# EAGLE design Main_Backup2 (EAGLE 7.2.0)
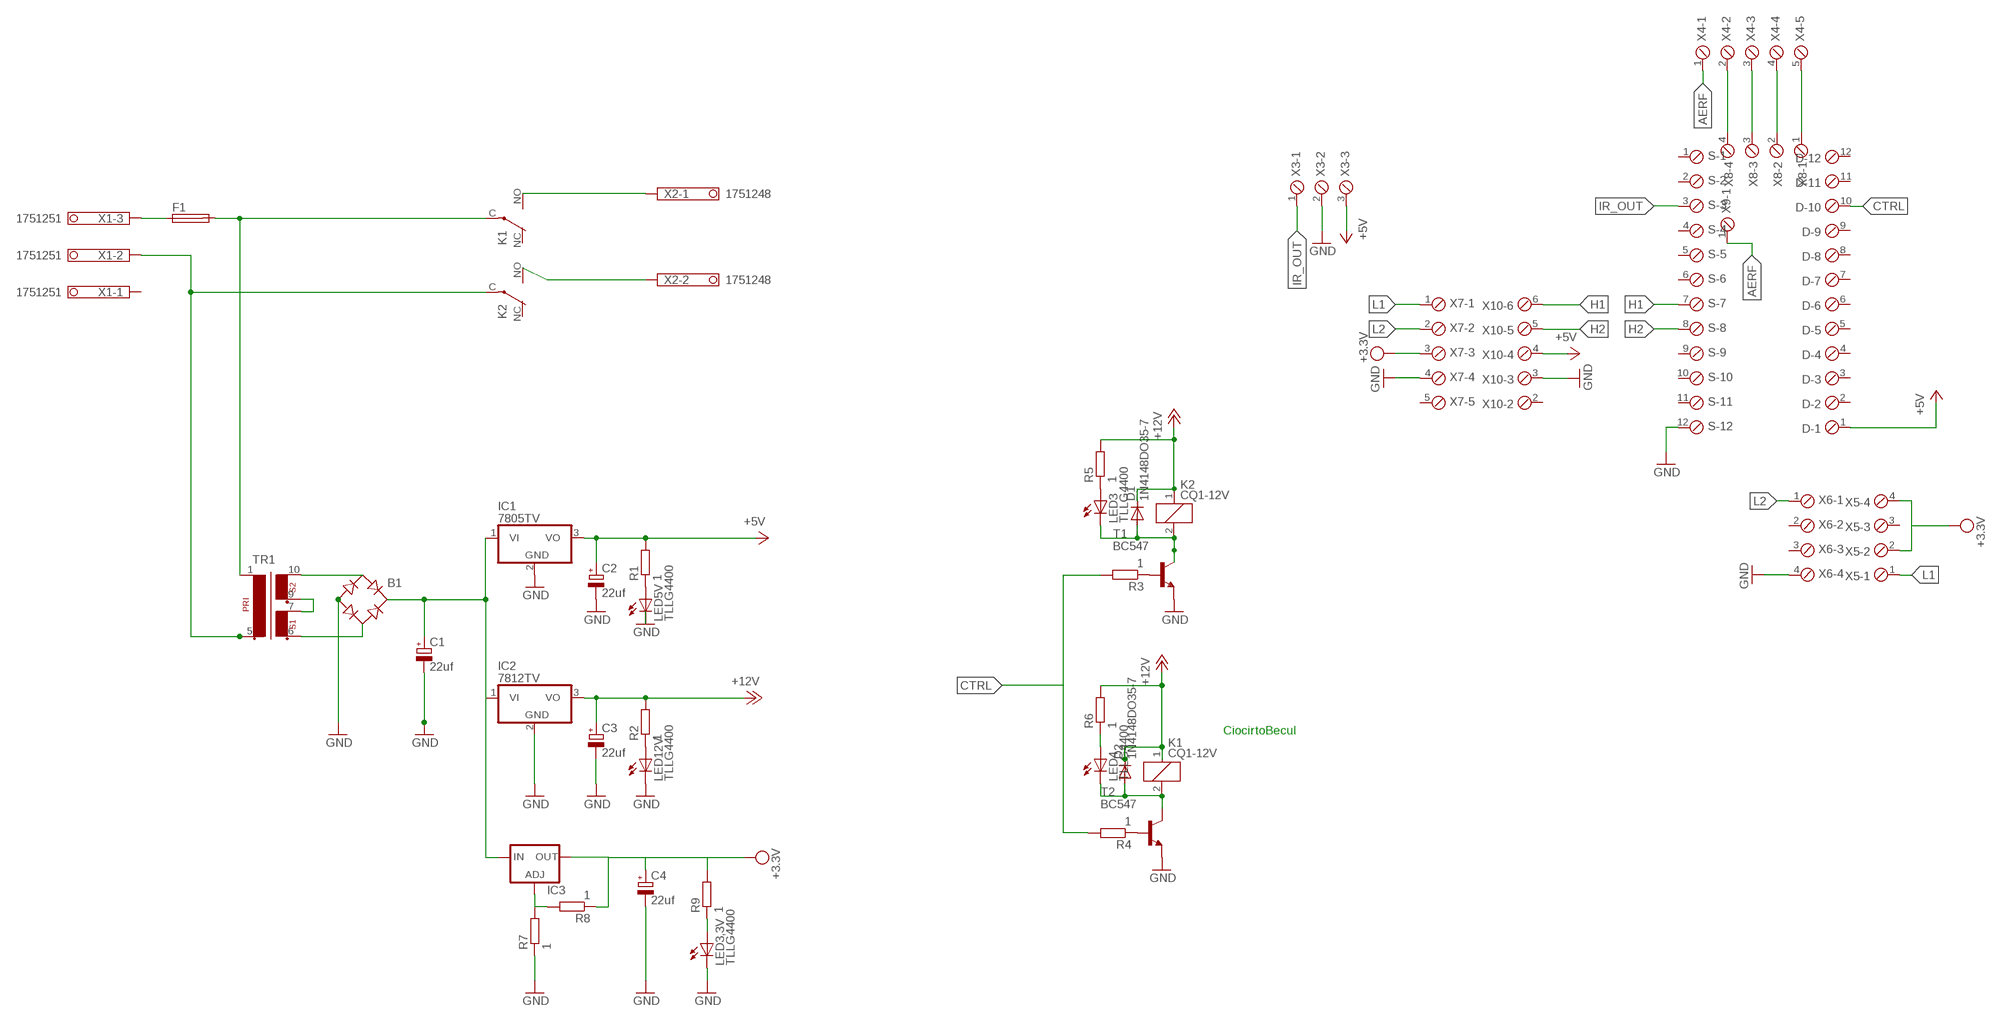
[diagram p0: schematic, sheet 1]

## Parts
B1  RB1A  [RB1A]
C1  22uf  CPOL-EUE2-4  [E2-4]
C2  22uf  CPOL-EUE2-4  [E2-4]
C3  22uf  CPOL-EUE2-4  [E2-4]
C4  22uf  CPOL-EUE2-4  [E2-4]
D  MPT12  [12POL254]
D1  1N4148DO35-7  [DO35-7]
D2  1N4148DO35-7  [DO35-7]
F1  SH25  [SH25]
IC1  7805TV  [TO220V]
IC2  7812TV  [TO220V]
IC3  LM317TS  [317TS]
K1  CQ1-12V  [CQ1]
K2  CQ1-12V  [CQ1]
LED3  TLLG4400  [LED3MM]
LED3,3V  TLLG4400  [LED3MM]
LED4  TLLG4400  [LED3MM]
LED5V  TLLG4400  [LED3MM]
LED12V  TLLG4400  [LED3MM]
R1  1  R-EU_0204/5  [0204/5]
R2  1  R-EU_0204/5  [0204/5]
R3  1  R-EU_0204/5  [0204/5]
R4  1  R-EU_0204/5  [0204/5]
R5  1  R-EU_0204/5  [0204/5]
R6  1  R-EU_0204/5  [0204/5]
R7  1  R-EU_0204/5  [0204/5]
R8  1  R-EU_0204/5  [0204/5]
R9  1  R-EU_0204/5  [0204/5]
S  MPT12  [12POL254]
T1  BC547  [TO92]
T2  BC547  [TO92]
TR1  EI30-2  [EI30-2]
X1  1751251  [1751251]
X2  1751248  [1751248]
X3  MPT3  [3POL254]
X4  MPT5  [5POL254]
X5  MPT4  [4POL254]
X6  MPT4  [4POL254]
X7  MPT6  [6POL254]
X8  MPT4  [4POL254]
X9  MPT2  [2POL254]
X10  MPT6  [6POL254]

## Nets
+5V: C2.+ D.1 IC1.3(VO) R1.2 X3.3 X10.4
+12V: C3.+ D1.C D2.C IC2.3(VO) K1.1 K2.1 R2.2 R5.2 R6.2
AERF: X4.1 X9.1
CTRL: D.10 R3.2 R4.2
GND: B1.- C1.- C2.- C3.- C4.- IC1.2(GND) IC2.2(GND) LED3,3V.K(C) LED5V.K(C) LED12V.K(C) R7.1 S.12 T1.1(E) T2.1(E) X3.2 X6.4 X7.4 X10.3
H1: S.7 X10.6
H2: S.8 X10.5
IR_OUT: S.3 X3.1
L1: X5.1 X7.1
L2: X6.1 X7.2
N$1: F1.2 K1.C(2:P) TR1.1
N$2: K2.C(2:P) TR1.5 X1.2
N$3: K1.NO(2:S) X2.1
N$4: K2.NO(2:S) X2.2
N$5: TR1.7 TR1.9
N$6: B1.AC1 TR1.10
N$7: B1.AC2 TR1.6
N$8: B1.+ C1.+ IC1.1(VI) IC2.1(VI) IC3.3(IN)
N$9: D1.A K2.2 LED3.K(C) T1.3(C)
N$10: LED12V.A R2.1
N$11: LED3.A R5.1
N$12: D2.A K1.2 LED4.K(C) T2.3(C)
N$13: LED5V.A R1.1
N$14: R3.1 T1.2(B)
N$15: R4.1 T2.2(B)
N$16: X4.5 X8.1
N$17: F1.1 X1.3
N$18: LED4.A R6.1
N$19: IC3.1(ADJ) R7.2 R8.2
N$20: LED3,3V.A R9.1
N$23: X4.3 X8.3
N$24: X4.4 X8.2
N$25: X4.2 X8.4
VCC: C4.+ IC3.2(OUT) R8.1 R9.2 X5.2 X5.4 X7.3 ; supply symbol labelled +3.3V
Unconnected: D.2 D.3 D.4 D.5 D.6 D.7 D.8 D.9 D.11 D.12 K1.NC(2:O) K2.NC(2:O) S.1 S.2 S.4 S.5 S.6 S.9 S.10 S.11 X1.1 X5.3 X6.2 X6.3 X7.5 X7.6 X9.2 X10.1 X10.2

## Notes on the sheet
- CiocirtoBecul

## Library data of the parts
B1 = rectifier:RB1A: RECTIFIER 1 A
C1-C4 = rcl:CPOL-EU: POLARIZED CAPACITOR, European symbol
D S = con-phoenix-254:MPT12: PHOENIX CONNECTOR; OC_FARNELL: unknown; OC_NEWARK: unknown
D1 D2 = diode:1N4148: DIODE high speed (Philips)
F1 = fuse:SH25: FUSE HOLDER grid 25 mm, OGN0031 8211, Schurter (Buerklin); MF: SCHURTER; MPN: 0031.8211; OC_FARNELL: 1162741; OC_NEWARK: 96B9380
IC1 IC2 = linear:78*: Positive VOLTAGE REGULATOR Source: http://cache.national.com/ds/LM/LM78L05.pdf http://www.fairchildsemi.com/ds/LM/LM7805.pdf
IC3 = v-reg:LM317TS: VOLTAGE REGULATOR
K1 K2 = relay:CQ1-12V: AUTOMOTIVE QUIET RELAY NAiS Source: http://www.mew-europe.com/.. en_ds_61208_0000.pdf; OC_FARNELL: unknown; OC_NEWARK: unknown
LED3 LED3,3V LED4 LED5V LED12V = led:TLLG4400: Low Current (2mA) LED 3 mm Tinted Diffused Package color GREEN Source: Data sheet <http://www.farnell.com/datasheets/391098.pdf>; MF: VISHAY SEMICONDUCTOR; OC_FARNELL: 1612435
R1-R9 = rcl:R-EU_: RESISTOR, European symbol
T1 T2 = transistor:BC547: NPN TRANSISTOR
TR1 = trafo:EI30-2: TRANSFORMER 1 primary winding, 2 secondary windings ERA
X1 = con-phoenix-350:1751251: MKDS 1/ 3-3,5 Printklemme Nennstrom: 10 A Bemessungsspannung: 160 V Raster: 3,5 mm Polzahl: 3 Montageart: Löten Anschlussart: Schraubanschluss Anschlussrichtung vom Leiter zur Platine: 0° Source: http://eshop.phoenixcontact.com .. 1751251.pdf; OC_FARNELL: unknown; OC_NEWARK: unknown
X2 = con-phoenix-350:1751248: MKDS 1/ 2-3,5 Printklemme Nennstrom: 10 A Bemessungsspannung: 160 V Raster: 3,5 mm Polzahl: 2 Montageart: Löten Anschlussart: Schraubanschluss Anschlussrichtung vom Leiter zur Platine: 0° Source: http://eshop.phoenixcontact.com .. 1751248.pdf; OC_FARNELL: unknown; OC_NEWARK: unknown
X3 = con-phoenix-254:MPT3: PHOENIX CONNECTOR; OC_FARNELL: unknown; OC_NEWARK: unknown
X4 = con-phoenix-254:MPT5: PHOENIX CONNECTOR; OC_FARNELL: unknown; OC_NEWARK: unknown
X5 X6 X8 = con-phoenix-254:MPT4: PHOENIX CONNECTOR; OC_FARNELL: unknown; OC_NEWARK: unknown
X7 X10 = con-phoenix-254:MPT6: PHOENIX CONNECTOR; OC_FARNELL: unknown; OC_NEWARK: unknown
X9 = con-phoenix-254:MPT2: PHOENIX CONNECTOR; OC_FARNELL: unknown; OC_NEWARK: unknown

## Net classes
0 default: width 0.61 mm

## Board
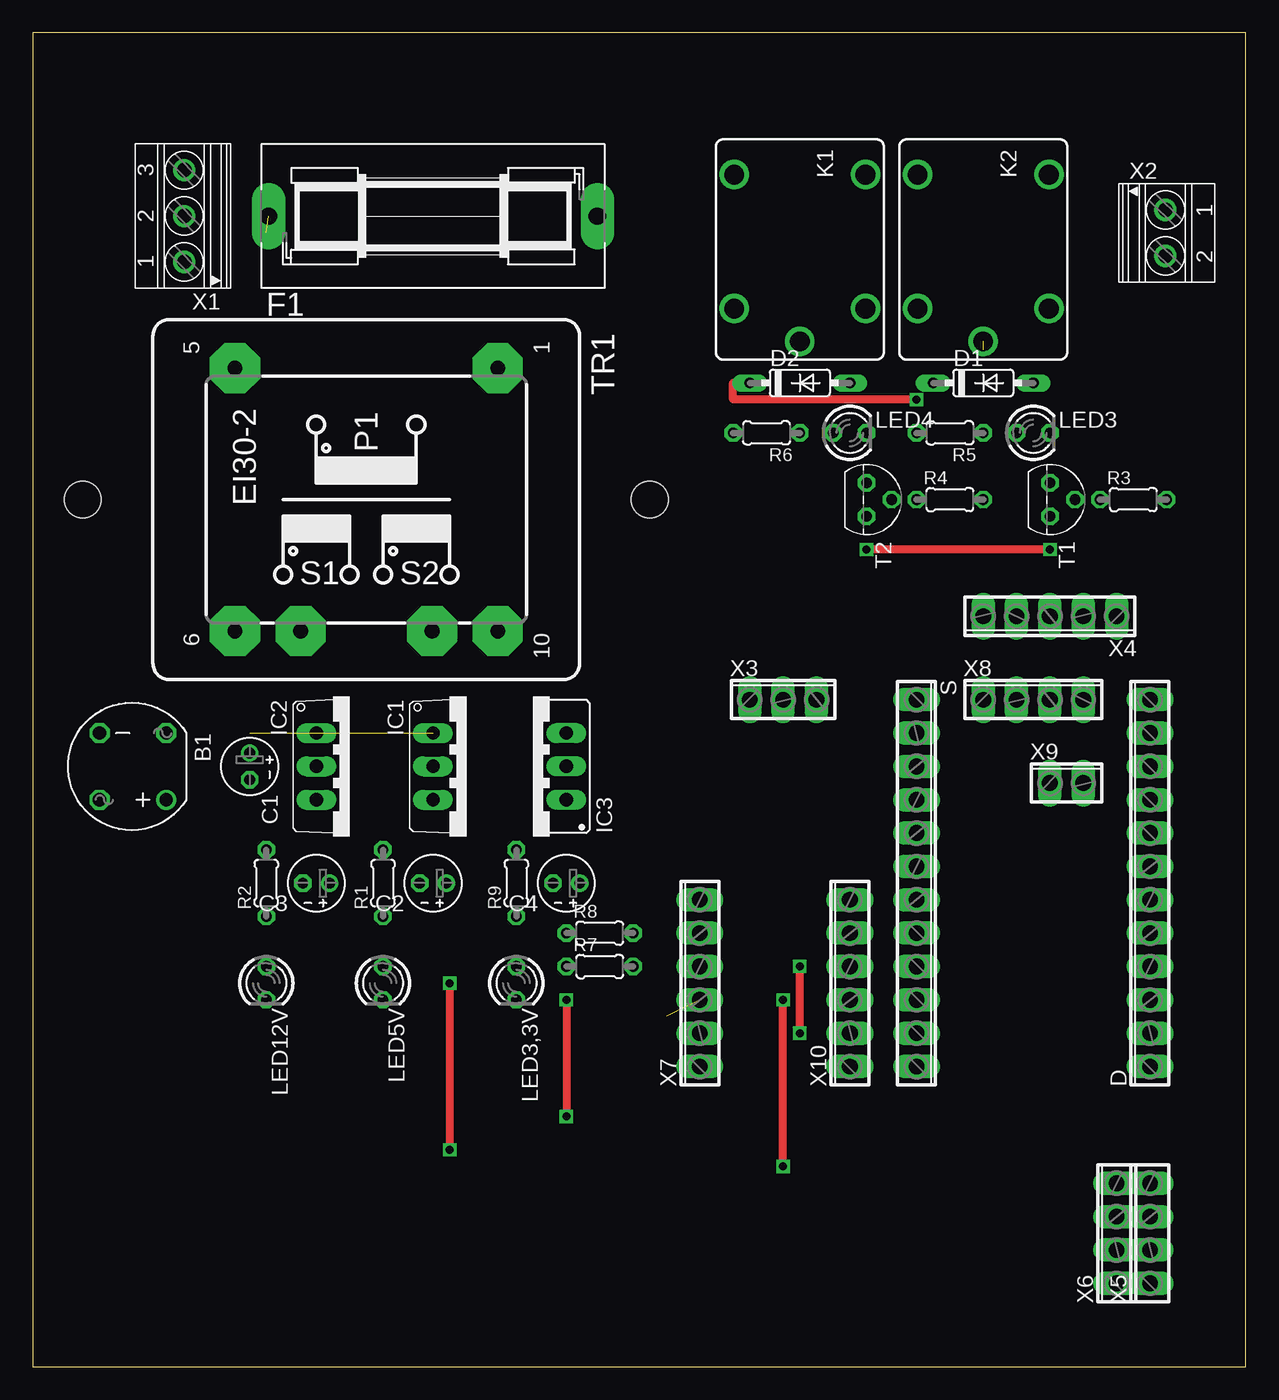
[diagram p1: board, top side]
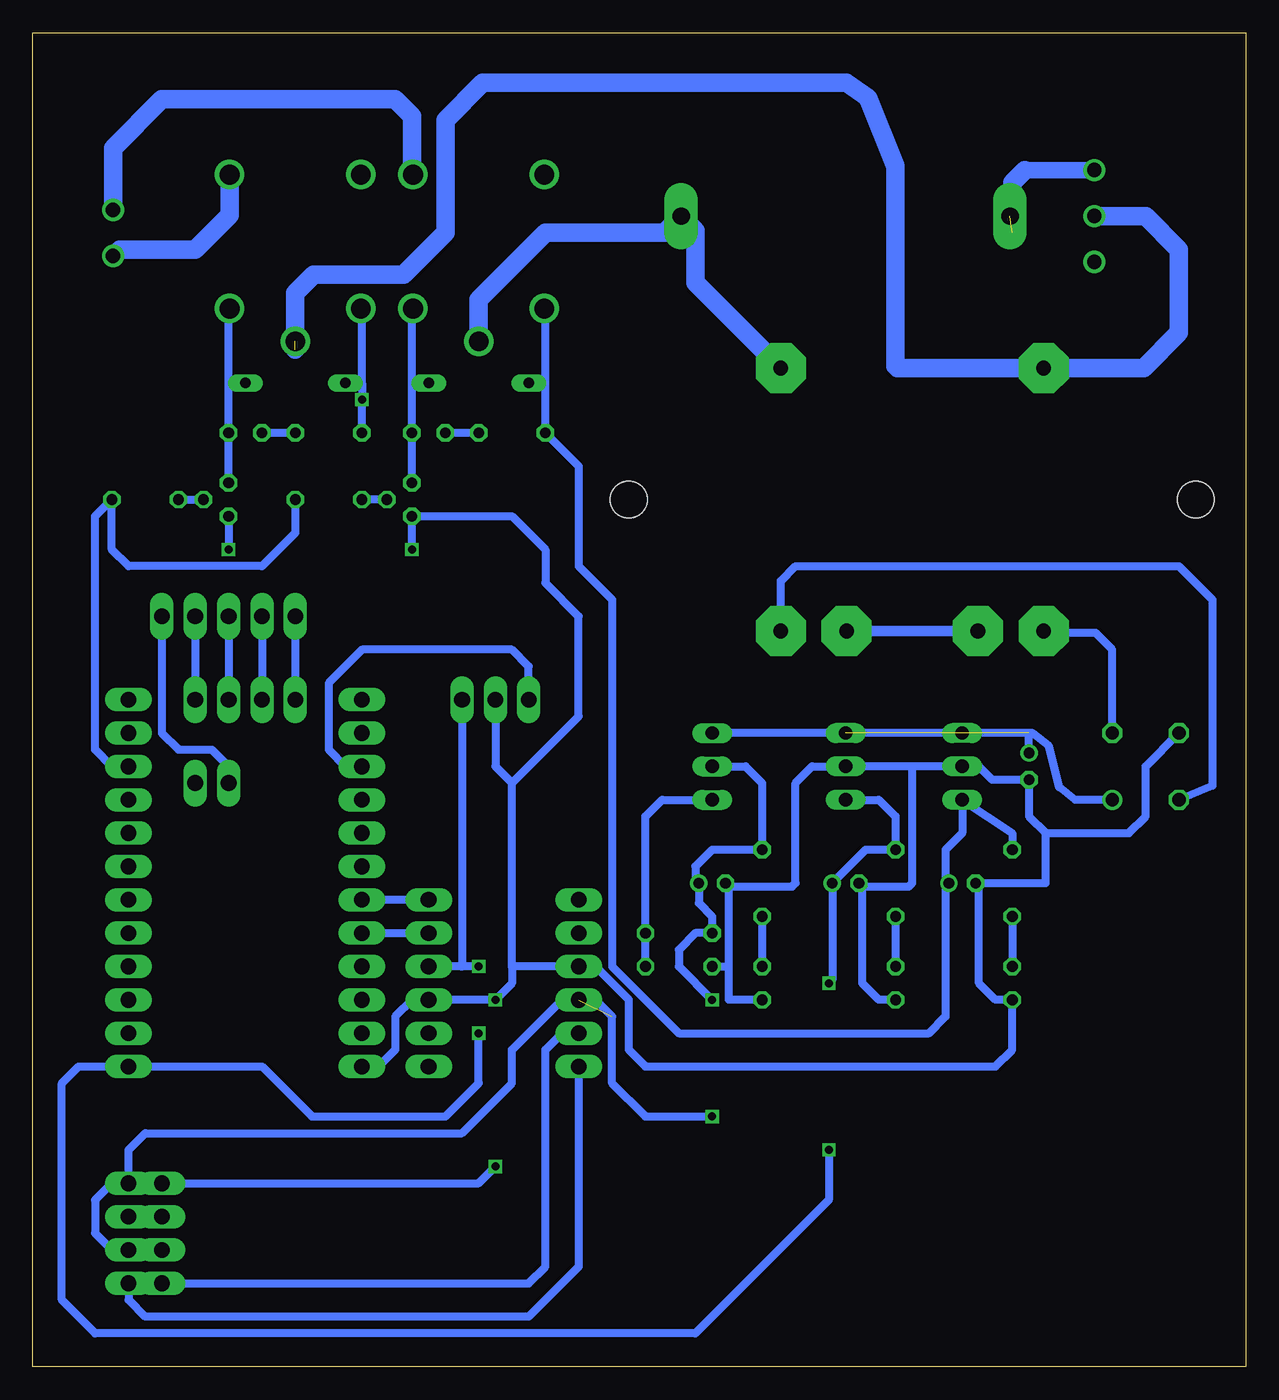
[diagram p2: board, bottom side, seen from below]

Size 92.38 x 101.59 mm. Coordinates in mm from the lower left corner, seen from the top.
Outline: 0,0 92.38,0 92.38,101.59 0,101.59 0,0
Copper layers (1*16): Top 0.035mm / dielectric 1.5mm / Bottom 0.035mm
Design rules "default": minimum track width 10mil, minimum drill 24mil, track to track 8mil, track to pad 8mil, pad to pad 8mil, via to via 8mil, smd to smd 8mil, copper to edge 40mil, drill to drill 8mil, minimum pad ring 10mil, minimum via ring 8mil, stop-mask expansion 4mil, vias tented up to drill 0mil, thermal gap 10mil
Holes 2.8 mm at 3.81,66.04 46.99,66.04

### Footprints (pad centres in the part's own frame; a part is rotated, then mirrored left to right if it is on the bottom)
RB1A = drill 1.016: + -2.54,2.54 | drill 1.016 octagon: - 2.54,-2.54; AC1 2.54,2.54; AC2 -2.54,-2.54
E2-4 = drill 0.813 pad 1.27: + -1.016,0 | drill 0.813 pad 1.27 octagon: - 1.016,0
12POL254 = drill 1.2 long: 1 -13.97,0; 2 -11.43,0; 3 -8.89,0; 4 -6.35,0; 5 -3.81,0; 6 -1.27,0; 7 1.27,0; 8 3.81,0; 9 6.35,0; 10 8.89,0; 11 11.43,0; 12 13.97,0
DO35-7 = drill 0.813 long: A 3.81,0; C -3.81,0
SH25 = drill 1.321 pad 2.54 long: 1 -12.522,0; 2 12.522,0
TO220V = drill 1.016 long: 1 -2.54,-2.54; 2 0,-2.54; 3 2.54,-2.54
317TS = drill 1.016 long: 1 -2.54,-2.54; 2 0,-2.54; 3 2.54,-2.54
CQ1 = drill 1.5: 1 4.5,-5; 2 4.5,5; C 7,0; NC -5.7,-5; NO -5.7,5
LED3MM = drill 0.813 octagon: A -1.27,0; K 1.27,0
0204/5 = drill 0.813 octagon: 1 -2.54,0; 2 2.54,0
TO92 = drill 0.813 octagon: 1 1.27,0; 2 0,1.905; 3 -1.27,0
EI30-2 = drill 1.118 pad 3.81 octagon: 1 -10.008,10.008; 5 -10.008,-10.008; 6 10.008,-10.008; 7 10.008,-5.004; 9 10.008,5.004; 10 10.008,10.008
1751251 = drill 1.1 pad 1.7: 1 -3.5,-0.1; 2 0,-0.1; 3 3.5,-0.1
1751248 = drill 1.1 pad 1.7: 1 -1.75,-0.1; 2 1.75,-0.1
3POL254 = drill 1.2 long: 1 -2.54,0; 2 0,0; 3 2.54,0
5POL254 = drill 1.2 long: 1 -5.08,0; 2 -2.54,0; 3 0,0; 4 2.54,0; 5 5.08,0
4POL254 = drill 1.2 long: 1 -3.81,0; 2 -1.27,0; 3 1.27,0; 4 3.81,0
6POL254 = drill 1.2 pad 1.778 long: 1 -6.35,0; 2 -3.81,0; 3 -1.27,0; 4 1.27,0; 5 3.81,0; 6 6.35,0
2POL254 = drill 1.2 long: 1 -1.27,0; 2 1.27,0

### Placement (x,y rotation side)
B1  7.62,45.72 180 top
C1  16.51,45.72 270 top
C2  30.48,36.83 180 top
C3  21.59,36.83 180 top
C4  40.64,36.83 180 top
D  85.09,36.83 90 top
D1  72.39,74.93 0 top
D2  58.42,74.93 0 top
F1  30.48,87.63 0 top
IC1  33.02,45.72 270 top
IC2  24.13,45.72 270 top
IC3  38.1,45.72 90 top
K1  58.42,85.09 270 top
K2  72.39,85.09 270 top
LED3  76.2,71.12 0 top
LED3,3V  36.83,29.21 270 top
LED4  62.23,71.12 0 top
LED5V  26.67,29.21 270 top
LED12V  17.78,29.21 270 top
R1  26.67,36.83 90 top
R2  17.78,36.83 90 top
R3  83.82,66.04 0 top
R4  69.85,66.04 0 top
R5  69.85,71.12 180 top
R6  55.88,71.12 180 top
R7  43.18,30.48 0 top
R8  43.18,33.02 0 top
R9  36.83,36.83 90 top
S  67.31,36.83 270 top
T1  77.47,66.04 270 top
T2  63.5,66.04 270 top
TR1  25.4,66.04 270 top
X1  11.43,87.63 90 top
X2  86.36,86.36 270 top
X3  57.15,50.8 0 top
X4  77.47,57.15 180 top
X5  85.09,10.16 90 top
X6  82.55,10.16 90 top
X7  50.8,29.21 90 top
X8  76.2,50.8 0 top
X9  78.74,44.45 0 top
X10  62.23,29.21 90 top

### Tracks (layer width: path | path; a pad name or v marks a point on that pad's centre or on a via)
+5V  (via drill 0.61)
  Top 0.61: v58.42,25.4 v58.42,30.48 | v31.75,29.21 v31.75,16.51
  Bottom 0.61: 60.96,30.48 X10.4 59.69,30.48 | X3.3 59.69,30.48 | v31.75,16.51 31.75,12.7 41.91,2.54 87.63,2.54 90.17,5.08 90.17,21.59 88.9,22.86 D.1 74.93,22.86 71.12,19.05 60.96,19.05 58.42,21.59 v58.42,25.4 | v58.42,30.48 59.69,30.48 | IC1.3 27.94,43.18 26.67,41.91 R1.2 28.96,39.37 C2.+ 31.5,29.46 v31.75,29.21
+12V  (via drill 0.61 pad 0.61)
  Top 0.61: v67.31,73.66 53.34,73.66 53.34,74.93 D2.C
  Bottom 0.61: R2.2 17.78,40.64 IC2.3 21.59,40.64 22.86,39.37 22.86,37.08 | 22.86,37.08 C3.+ | D2.C 53.34,74.93 | 53.34,74.93 53.34,80.51 K1.1 | D1.C 67.31,74.93 | 67.31,74.93 67.31,80.51 K2.1 | 53.34,74.93 R6.2 50.8,68.58 50.8,60.96 48.26,58.42 48.26,30.48 43.18,25.4 24.13,25.4 22.86,26.67 22.86,37.08 | R5.2 v67.31,73.66 67.31,74.93
AERF
  Bottom 0.61: X4.1 82.55,48.26 81.28,46.99 78.74,46.99 77.47,45.72 X9.1
CTRL
  Bottom 0.61: R4.2 72.39,63.5 74.93,60.96 85.09,60.96 86.36,62.23 R3.2 87.63,64.77 87.63,46.99 86.36,45.72 D.10
GND  (via drill 0.61, 0.61 pad 0.61)
  Top 0.61: v77.47,62.23 v63.5,62.23 | v57.15,15.24 v57.15,27.94
  Bottom 0.61: 25.4,45.72 IC2.2 20.32,45.72 19.3,44.7 C1.- 16.51,41.91 15.24,40.64 | 25.4,45.72 IC1.2 33.02,45.72 34.29,44.45 34.29,36.83 34.54,36.58 39.62,36.58 | 15.24,40.64 8.89,40.64 7.62,41.91 7.62,45.72 B1.- | 20.32,36.58 20.32,29.21 19.05,27.94 LED12V.K 17.78,24.13 19.05,22.86 45.72,22.86 46.99,24.13 46.99,27.94 49.53,30.48 X7.4 55.88,30.48 | 20.32,36.58 C3.- 20.32,36.83 | LED5V.K 27.94,27.94 29.21,29.21 29.21,36.58 | 29.21,36.58 C2.- | LED3,3V.K 39.37,27.94 39.37,30.48 | 39.37,30.48 39.37,36.58 C4.- 39.62,36.58 | 39.62,36.58 39.37,36.83 | 20.32,36.83 20.32,36.58 | 20.32,36.83 15.24,36.83 15.24,40.64 | 29.21,36.58 25.65,36.58 25.4,36.83 25.4,45.72 | R7.1 39.37,30.48 | T1.1 v77.47,62.23 | v63.5,62.23 T2.1 55.88,64.77 53.34,62.23 53.34,59.69 50.8,57.15 50.8,49.53 55.88,44.45 | 55.88,30.48 55.88,44.45 | 55.88,30.48 55.88,29.21 v57.15,27.94 X10.3 63.5,27.94 64.77,26.67 64.77,24.13 66.04,22.86 S.12 | X6.4 58.42,13.97 v57.15,15.24 | X3.2 57.15,45.72 55.88,44.45
H1
  Bottom 0.61: X10.6 S.7
H2
  Bottom 0.61: S.8 X10.5
IR_OUT
  Bottom 0.61: X3.1 54.61,53.34 55.88,54.61 67.31,54.61 69.85,52.07 69.85,46.99 68.58,45.72 S.3
L1
  Bottom 0.61: X7.1 50.8,7.62 54.61,3.81 83.82,3.81 85.09,5.08 X5.1
L2
  Bottom 0.61: X6.1 54.61,6.35 53.34,7.62 53.34,24.13 52.07,25.4 X7.2
N$1
  Bottom 1.422: K1.C 58.42,81.28 53.34,86.36 44.27,86.36 F1.2 41.91,86.54 41.91,82.55 TR1.1
N$2  (1 unrouted)
  Bottom 0.61: 26.52,76.05 26.67,76.2
  Bottom 1.422: X1.2 7.62,87.63 5.08,85.09 5.08,78.74 7.77,76.05 TR1.5 26.52,76.05 | 26.67,76.2 26.67,91.44 28.76,96.66 30.43,97.79 58.12,97.79 60.96,94.95 60.96,86.35 64.14,83.17 70.98,83.17 72.39,81.76 72.39,77.47
N$3
  Bottom 0.61: 63.5,90.87 K1.NO
  Bottom 1.422: X2.1 86.26,92.81 82.55,96.52 64.77,96.52 63.5,95.25 63.5,90.87
N$4
  Bottom 0.61: 85.78,85.09 X2.2
  Bottom 1.422: K2.NO 77.39,87.71 80.01,85.09 85.78,85.09
N$5
  Bottom 0.813: TR1.9 TR1.7
N$6
  Bottom 0.61: TR1.10 35.41,59.84 34.29,60.96 5.08,60.96 2.54,58.42 2.54,44.23 B1.AC1
N$7
  Bottom 0.61: B1.AC2 10.16,54.61 11.43,55.88 15.24,55.88 TR1.6
N$8  (2 unrouted)
  Bottom 0.61: B1.+ 12.98,43.18 14.21,44.14 15,47.3 16.23,48.26 16.51,48.26 | 16.51,48.26 IC3.3 | C1.+ 16.51,48.26
N$9
  Bottom 0.61: D1.A 77.47,74.93 | 77.47,74.93 77.47,80.51 K2.2 | 77.47,74.93 LED3.K T1.3
N$10
  Bottom 0.61: R2.1 LED12V.A
N$11
  Bottom 0.61: R5.1 LED3.A
N$12
  Bottom 0.61: D2.A 63.5,74.93 | 63.5,74.93 63.5,80.51 K1.2 | 63.5,74.93 LED4.K T2.3
N$13
  Bottom 0.61: R1.1 LED5V.A
N$14
  Bottom 0.61: R3.1 T1.2
N$15
  Bottom 0.61: T2.2 R4.1
N$16
  Bottom 0.61: X4.5 X8.1
N$17  (1 unrouted)
  Bottom 1.27: X1.3 16.82,91.13
  Bottom 1.422: 16.82,91.13 17.78,90.17 17.78,86.36
N$18
  Bottom 0.61: R6.1 LED4.A
N$19
  Bottom 0.61: R7.2 R8.2 45.72,41.91 44.45,43.18 IC3.1
N$20
  Bottom 0.61: R9.1 LED3,3V.A
N$23
  Bottom 0.61: X4.3 X8.3
N$24
  Bottom 0.61: X4.4 X8.2
N$25
  Bottom 0.61: X4.2 X8.4
VCC  (via drill 0.61)  (1 unrouted)
  Top 0.61: v40.64,27.94 v40.64,19.05
  Bottom 0.61: IC3.2 38.1,45.72 36.83,44.45 R9.2 40.64,39.37 41.91,38.1 41.91,37.08 C4.+ 41.66,35.31 40.64,34.29 R8.1 41.91,33.02 43.18,31.75 43.18,30.48 v40.64,27.94 | v40.64,19.05 45.72,19.05 48.26,21.59 48.26,26.67 49.53,27.94 X7.3 52.07,27.94 55.88,24.13 55.88,21.59 59.69,17.78 83.82,17.78 85.09,16.51 X5.4 86.36,13.97 87.63,12.7 87.63,10.16 86.36,8.89 X5.2